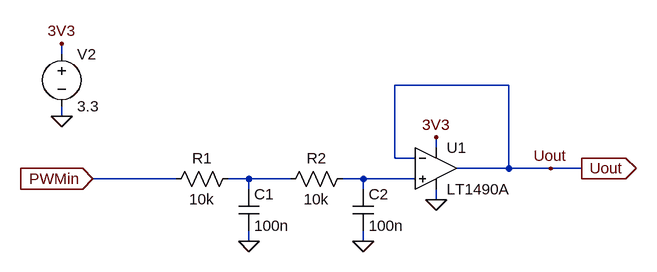
[diagram p0: schematic pwm_filter_v1.asc]
pwm_filter_v1.asc, the LTspice schematic file:
Version 4
SHEET 1 1648 680
WIRE -384 -208 -384 -224
WIRE 304 -160 128 -160
WIRE -384 -112 -384 -128
WIRE 192 -64 192 -80
WIRE 128 -48 128 -160
WIRE 160 -48 128 -48
WIRE 304 -32 304 -160
WIRE 304 -32 224 -32
WIRE 368 -32 304 -32
WIRE 416 -32 368 -32
WIRE -208 -16 -336 -16
WIRE -96 -16 -128 -16
WIRE -32 -16 -96 -16
WIRE 80 -16 48 -16
WIRE 160 -16 80 -16
WIRE -96 0 -96 -16
WIRE 80 0 80 -16
WIRE 192 16 192 0
WIRE -96 80 -96 64
WIRE 80 80 80 64
FLAG 192 16 0
FLAG -96 80 0
FLAG 80 80 0
FLAG -384 -112 0
FLAG -384 -224 3V3
FLAG 192 -80 3V3
FLAG 368 -32 Uout
FLAG 416 -32 Uout
IOPIN 416 -32 Out
FLAG -336 -16 PWMin
IOPIN -336 -16 In
SYMBOL res -112 -32 R90
WINDOW 0 0 56 VBottom 2
WINDOW 3 32 56 VTop 2
SYMATTR InstName R1
SYMATTR Value 10k
SYMBOL res 64 -32 R90
WINDOW 0 0 56 VBottom 2
WINDOW 3 32 56 VTop 2
SYMATTR InstName R2
SYMATTR Value 10k
SYMBOL cap -112 0 R0
SYMATTR InstName C1
SYMATTR Value 100n
SYMBOL cap 64 0 R0
SYMATTR InstName C2
SYMATTR Value 100n
SYMBOL Opamps\\LT1490A 192 -96 R0
SYMATTR InstName U1
SYMBOL voltage -384 -224 R0
WINDOW 123 0 0 Left 0
WINDOW 39 0 0 Left 0
SYMATTR InstName V2
SYMATTR Value 3.3

The netlist it stands for:
* pwm_filter_v1.asc
R1 N001 PWMin 10k
R2 N002 N001 10k
C1 N001 0 100n
C2 N002 0 100n
XU1 N002 Uout 3V3 0 Uout LT1490A  ; pins In+ In- V+ V- OUT
V2 3V3 0 3.3
.backanno
.end